# EAGLE design lcdArduinoshield (EAGLE 6.2)
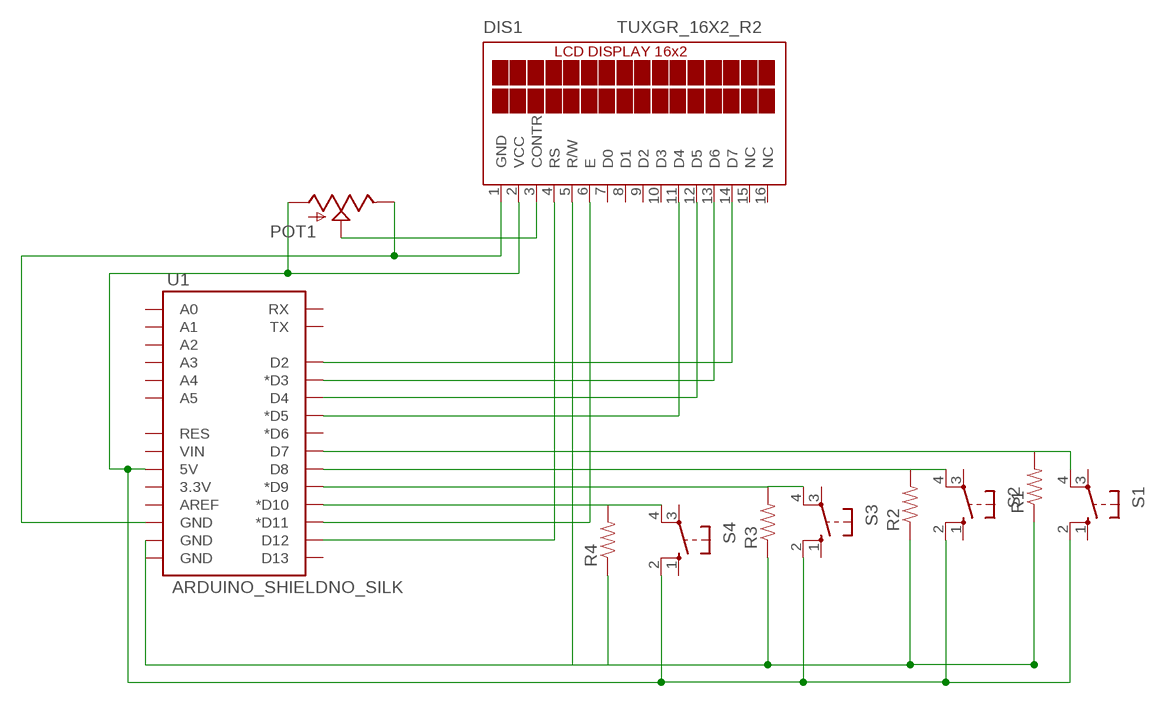
[diagram p0: schematic, sheet 1]

## Parts
DIS1  TUXGR_16X2_R2  [TUXGR_16X2_R2]
POT1  POT100K_3362U  [3362U]
R1  RESISTORPTH-1/4W  [AXIAL-0.4]
R2  RESISTORPTH-1/4W  [AXIAL-0.4]
R3  RESISTORPTH-1/4W  [AXIAL-0.4]
R4  RESISTORPTH-1/4W  [AXIAL-0.4]
S1  10-XX  [B3F-10XX]
S2  10-XX  [B3F-10XX]
S3  10-XX  [B3F-10XX]
S4  10-XX  [B3F-10XX]
U1  ARDUINO_SHIELDNO_SILK  [DUEMILANOVE_VIAS]

## Nets
+5V: DIS1.2(VCC) POT1.P$3(A) S1.2(S1) S2.2(S1) S3.2(S1) S4.2(S1) U1.5V
GND: DIS1.1(GND) POT1.P$1(E) U1.GND@2(GND)
GND1: DIS1.5(R/W) R1.P$1 R2.P$1 R3.P$1 R4.P$1 U1.GND@0(GND) U1.GND@1(GND)
N$1: DIS1.14(D7) U1.D2
N$2: DIS1.13(D6) U1.D3(*D3)
N$3: DIS1.12(D5) U1.D4
N$4: DIS1.11(D4) U1.D5(*D5)
N$5: DIS1.6(E) U1.D11(*D11)
N$6: R4.P$2 S4.4(P1) U1.D10(*D10)
N$7: DIS1.4(RS) U1.D12
N$8: R3.P$2 S3.4(P1) U1.D9(*D9)
N$9: R2.P$2 S2.4(P1) U1.D8
N$10: R1.P$2 S1.4(P1) U1.D7
POTDIV: DIS1.3(CONTR) POT1.P$2(S)
Unconnected: DIS1.7(D0) DIS1.8(D1) DIS1.9(D2) DIS1.10(D3) DIS1.15(NC) DIS1.16(NC) S1.1(S) S1.3(P) S2.1(S) S2.3(P) S3.1(S) S3.3(P) S4.1(S) S4.3(P) U1.3.3V U1.A0 U1.A1 U1.A2 U1.A3 U1.A4 U1.A5 U1.AREF U1.D6(*D6) U1.D13 U1.RES U1.RX U1.TX U1.VIN

## Library data of the parts
DIS1 = display-lcd:TUXGR_16X2_R2: Tuxgraphics LCD display 16x2 characters reflective, without background light Source: tuxgr_12x2_r2.pdf
POT1 = SparkFun:POT
R1-R4 = SparkFun-Resistors:RESISTOR: Resistor Basic schematic elements and footprints for 0603, 1206, and PTH resistors.
S1-S4 = switch-omron:10-XX: OMRON SWITCH; MPN: B3F-1000; OC_FARNELL: 176432; OC_NEWARK: 36M3542
U1 = SparkFun:ARDUINO_SHIELD

## Board
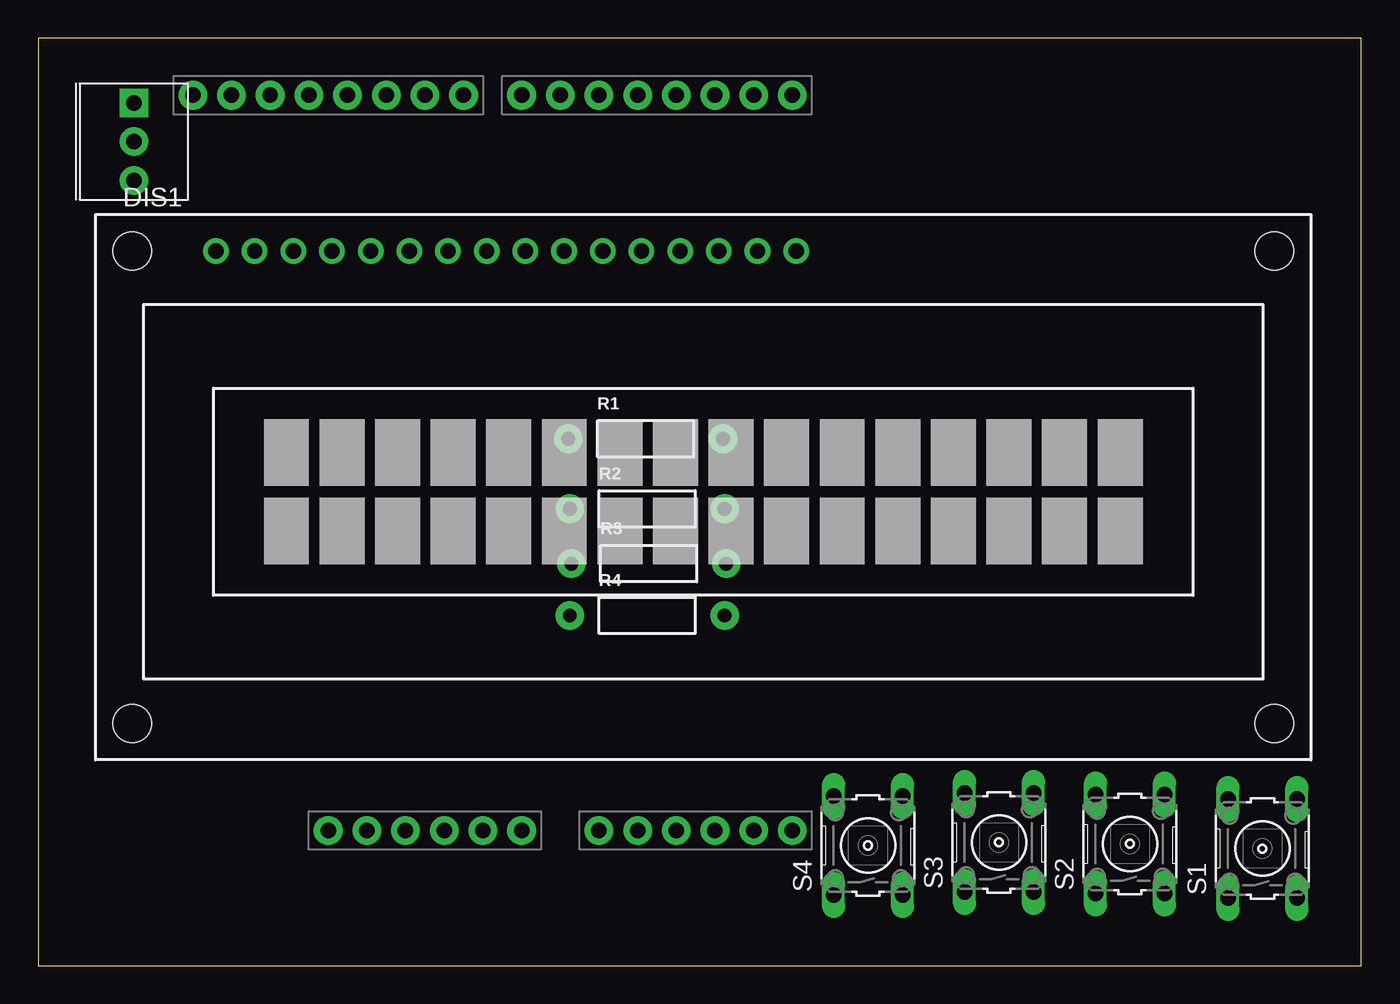
[diagram p1: board, top side]
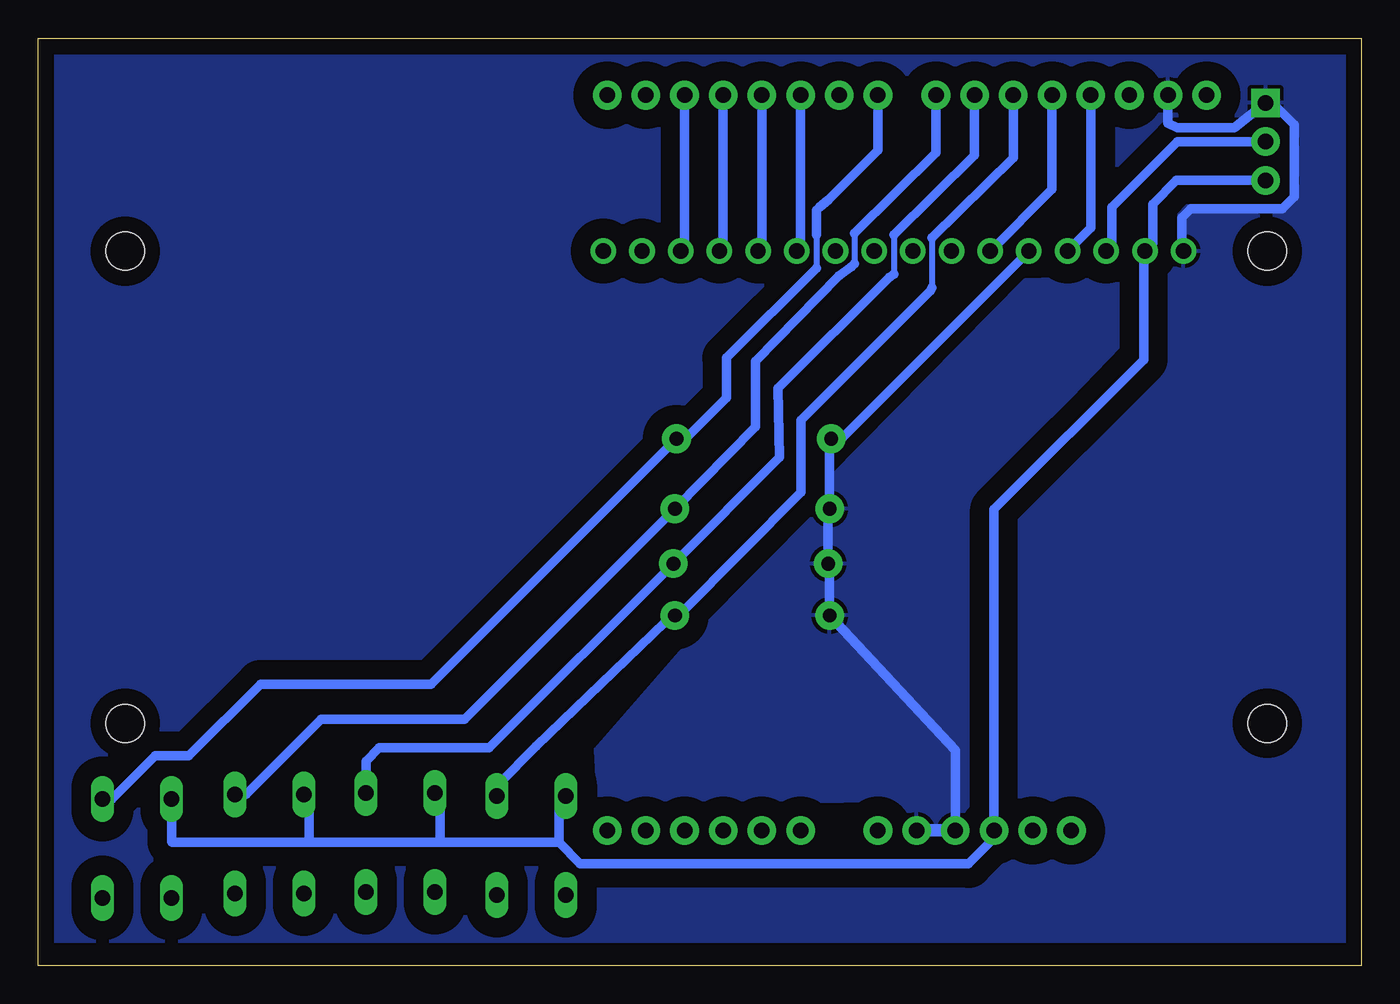
[diagram p2: board, bottom side, seen from below]

Size 86.9 x 60.9 mm. Coordinates in mm from the lower left corner, seen from the top.
Outline: 0,0 86.9,0 86.9,60.9 0,60.9 0,0
Copper layers (1*16): Top 0.035mm / dielectric 1.5mm / Bottom 0.035mm
Design rules: minimum track width 10mil, minimum drill 24mil, track to track 50mil, track to pad 20mil, pad to pad 20mil, via to via 20mil, smd to smd 8mil, copper to edge 40mil, drill to drill 8mil, minimum pad ring 10mil, minimum via ring 8mil, stop-mask expansion 4mil, vias tented up to drill 0mil, thermal gap 10mil

### Footprints (pad centres in the part's own frame; a part is rotated, then mirrored left to right if it is on the bottom)
TUXGR_16X2_R2 = drill 1 pad 1.676: 1 -32,15.5; 2 -29.46,15.5; 3 -26.92,15.5; 4 -24.38,15.5; 5 -21.84,15.5; 6 -19.3,15.5; 7 -16.76,15.5; 8 -14.22,15.5; 9 -11.68,15.5; 10 -9.14,15.5; 11 -6.6,15.5; 12 -4.06,15.5; 13 -1.52,15.5; 14 1.02,15.5; 15 3.56,15.5; 16 6.1,15.5 | hole 2.5: -37.5,-15.5; 37.5,-15.5; -37.5,15.5; 37.5,15.5
3362U = drill 1.016 pad 1.88 square: P$1 0,2.54 | drill 1.016 pad 1.88: P$2 2.54,2.54; P$3 5.08,2.54
AXIAL-0.4 = drill 0.9 pad 1.88: P$1 -5.08,0; P$2 5.08,0
B3F-10XX = drill 1.016 long: 1 -3.251,2.261; 2 3.251,2.261; 3 -3.251,-2.261; 4 3.251,-2.261
DUEMILANOVE_VIAS = drill 1.016 pad 1.88: 3.3V 50.8,13.97; 5V 50.8,16.51; A0 50.8,29.21; A1 50.8,31.75; A2 50.8,34.29; A3 50.8,36.83; A4 50.8,39.37; A5 50.8,41.91; AREF 2.54,2.54; D2 2.54,36.83; D3 2.54,34.29; D4 2.54,31.75; D5 2.54,29.21; D6 2.54,26.67; D7 2.54,24.13; D8 2.54,20.32; D9 2.54,17.78; D10 2.54,15.24; D11 2.54,12.7; D12 2.54,10.16; D13 2.54,7.62; GND@0 50.8,19.05; GND@1 50.8,21.59; GND@2 2.54,5.08; RES 50.8,11.43; RX 2.54,41.91; TX 2.54,39.37; VIN 50.8,24.13

### Placement (x,y rotation side)
DIS1  43.68,31.42 0 top
POT1  3.75,56.64 270 top
R1  39.9,34.6 0 top
R2  40,30 0 top
R3  40.1,26.4 0 top
R4  40,23 0 top
S1  80.4,7.7 90 top
S2  71.7,8 90 top
S3  63.1,8.1 90 top
S4  54.5,7.9 90 top
U1  7.62,59.69 270 top

### Tracks (layer width: path | path; a pad name or v marks a point on that pad's centre or on a via)
+5V
  Bottom 0.61: POT1.P$3 12.14,51.56 13.7,50 13.7,47.44 DIS1.2 14.3,46.84 14.3,39.8 24.13,29.97 U1.5V 24.13,8.37 25.8,6.7 51.3,6.7 52.7,8.1 | 52.6,10.79 S4.2 52.24,10.66 52.7,10.2 52.7,8.1 | 52.7,8.1 60.5,8.1 | 60.5,8.1 69.1,8.1 | 69.1,8.1 78.1,8.1 78.14,8.14 S1.2 | S2.2 69.1,10.91 69.1,8.1 | S3.2 60.5,11.01 60.5,8.1
GND
  Bottom 0.61: U1.GND@2 12.7,55.3 12.1,55 8.35,55 POT1.P$1 5.84,56.64 4.4,55.2 4.4,50.5 5.2,49.7 11.2,49.7 11.8,49.1 11.8,47.04 DIS1.1
  pour Bottom: 0.9,59.9 0.9,1.6 86.3,1.6 86.3,59.9
GND1
  Bottom 0.61: U1.GND@0 26.67,14.15 R4.P$1 34.92,26.3 R3.P$1 35.02,29.9 R2.P$1 34.92,34.5 R1.P$1 34.16,34.6 DIS1.5
  Bottom 0.813: U1.GND@1 U1.GND@0
  pour Bottom: 15.6,45.2 22.1,45 34.9,32 35,30.9 43.4,22.1 50.3,14.2 50.1,10.5 30.8,10.9 30.8,10.6 29.6,9.1 25.8,9.1 25.6,30.6 15.9,40.7 15.7,41.1
N$1
  Bottom 0.61: U1.D2 44.45,47.17 DIS1.14
N$2
  Bottom 0.61: U1.D3 41.91,47.17 DIS1.13
N$3
  Bottom 0.61: U1.D4 39.37,47.17 DIS1.12
N$4
  Bottom 0.61: U1.D5 36.83,47.17 DIS1.11
N$5
  Bottom 0.61: U1.D11 20.32,50.98 DIS1.6
N$6
  Bottom 0.406: 28.2,47.8 28.2,44.5
  Bottom 0.61: 44.6,23.2 45,22.8 45.7,22.6 54.2,14.4 56.7,11.9 56.76,11.94 S4.4 | 44.6,23.2 44.88,23.2 R4.P$2 | U1.D10 22.86,53.04 28.2,47.8 | 44.6,23.2 36.8,31.1 36.8,35.8 28.3,44.3 28.2,44.5
N$7
  Bottom 0.61: U1.D12 17.78,48.44 DIS1.4
N$8
  Bottom 0.406: 30.7,48 30.7,45.4
  Bottom 0.61: U1.D9 25.4,53.2 30.7,48 | 30.7,45.4 31,45.2 38.3,37.9 38.2,33.38 R3.P$2 57.28,14.3 64.5,14.3 65.36,13.44 S3.4
N$9
  Bottom 0.406: 33.3,48.1 33.3,46.1
  Bottom 0.61: U1.D8 27.94,53.36 33.3,48.1 | 33.3,46.1 33.5,45.9 34.3,45.3 39.8,39.7 39.8,35.38 R2.P$2 58.88,16.2 68.3,16.2 73.25,11.25 S2.4
N$10
  Bottom 0.406: 35.8,48 35.8,45.8
  Bottom 0.61: U1.D7 31.75,53.55 35,50.3 35.6,49.8 35.8,49.6 35.8,48 | 35.8,45.8 41.7,39.9 41.7,37.3 44.4,34.6 R1.P$2 61.08,18.5 72.3,18.5 77,13.8 79.2,13.8 82.05,10.95 S1.4
POTDIV
  Bottom 0.61: POT1.P$2 12.1,54.1 16.4,49.8 16.4,47.28 DIS1.3